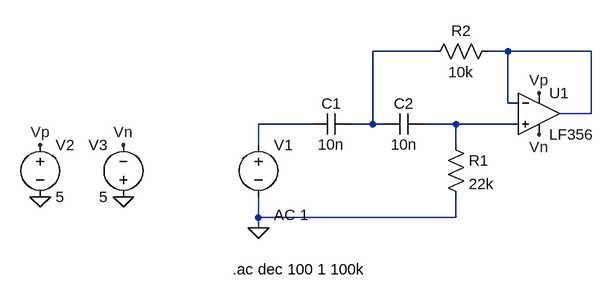
[diagram p0: schematic 2ndOrderHighPass_DCFilter.asc]
2ndOrderHighPass_DCFilter.asc, the LTspice schematic file:
Version 4
SHEET 1 880 680
WIRE 352 32 256 32
WIRE 464 32 432 32
WIRE 592 32 464 32
WIRE 464 112 464 32
WIRE 480 112 464 112
WIRE 592 128 592 32
WIRE 592 128 544 128
WIRE 160 144 80 144
WIRE 256 144 256 32
WIRE 256 144 224 144
WIRE 272 144 256 144
WIRE 384 144 336 144
WIRE 480 144 384 144
WIRE 80 176 80 144
WIRE 384 176 384 144
WIRE 80 288 80 256
WIRE 384 288 384 256
WIRE 384 288 80 288
WIRE 80 304 80 288
FLAG -256 256 0
FLAG -128 256 0
FLAG 80 304 0
FLAG -256 176 Vp
FLAG 512 96 Vp
FLAG -128 176 Vn
FLAG 512 160 Vn
SYMBOL voltage 80 160 R0
WINDOW 123 24 124 Left 2
WINDOW 39 0 0 Left 0
SYMATTR InstName V1
SYMATTR Value ""
SYMATTR Value2 AC 1
SYMBOL cap 224 128 R90
WINDOW 0 0 32 VBottom 2
WINDOW 3 32 32 VTop 2
SYMATTR InstName C1
SYMATTR Value 10n
SYMBOL cap 336 128 R90
WINDOW 0 0 32 VBottom 2
WINDOW 3 32 32 VTop 2
SYMATTR InstName C2
SYMATTR Value 10n
SYMBOL res 368 160 R0
SYMATTR InstName R1
SYMATTR Value 22k
SYMBOL res 448 16 R90
WINDOW 0 0 56 VBottom 2
WINDOW 3 32 56 VTop 2
SYMATTR InstName R2
SYMATTR Value 10k
SYMBOL LF356 512 64 R0
SYMATTR InstName U1
SYMBOL voltage -256 160 R0
WINDOW 123 0 0 Left 0
WINDOW 39 0 0 Left 0
SYMATTR InstName V2
SYMATTR Value 5
SYMBOL voltage -128 272 R180
WINDOW 0 24 96 Left 2
WINDOW 3 24 16 Left 2
WINDOW 123 0 0 Left 0
WINDOW 39 0 0 Left 0
SYMATTR InstName V3
SYMATTR Value 5
TEXT 40 368 Left 2 !.ac dec 100 1 100k

The netlist it stands for:
* 2ndOrderHighPass_DCFilter.asc
V1 N003 0 AC 1
C1 N001 N003 10n
C2 N004 N001 10n
R1 N004 0 22k
R2 N002 N001 10k
XU1 N004 N002 Vp Vn N002 LF356  ; pins In+ In- V+ V- OUT
V2 Vp 0 5
V3 0 Vn 5
.ac dec 100 1 100k
.lib LF356.sub
.backanno
.end